# Altium schematic sheet JESD204B.SchDoc: JESD204B
size A4 portrait; Author: Carlos Barreiro; Organization: Escuela Técnica Superior de Ingeniería de Sistemas Informáticos de la Universidad Politécnica de Madrid; Address1: Campus Sur de la Universidad Politécnica de Madrid; Address2: Calle de Alan Turing, s/nº; Address3: Madrid 28031; Address4: España
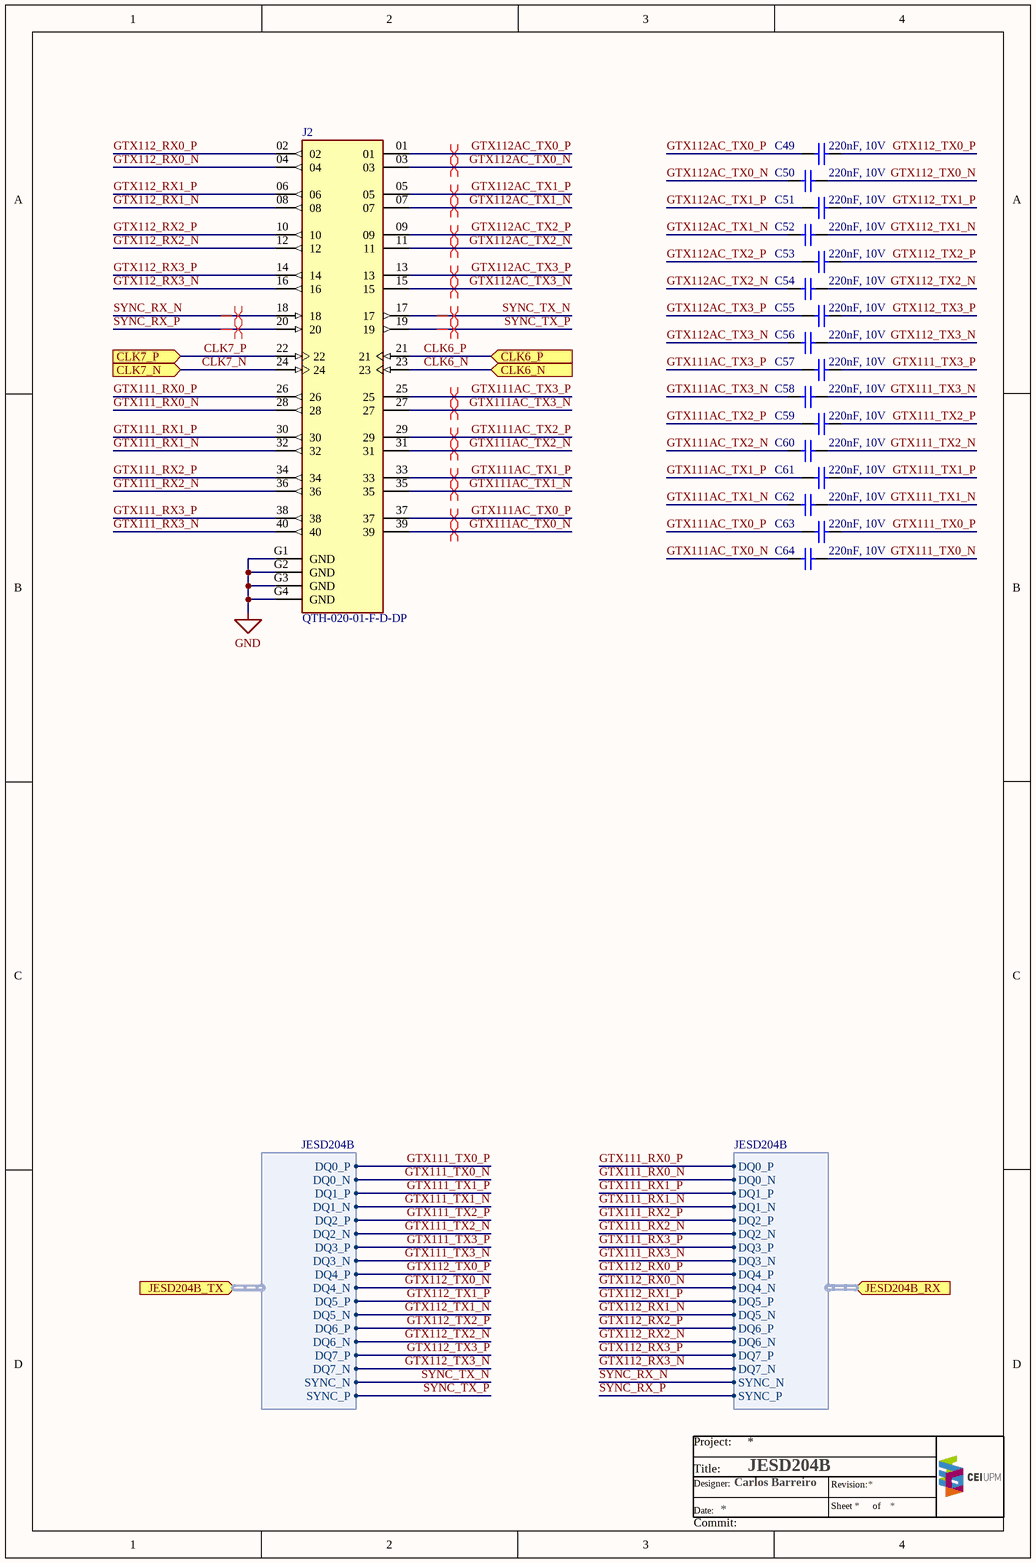
[diagram p0: JESD204B.SchDoc]

## Parts
C49  220nF, 10V  [WURTH_WCAP-CSGP_0402]
C50  220nF, 10V  [WURTH_WCAP-CSGP_0402]
C51  220nF, 10V  [WURTH_WCAP-CSGP_0402]
C52  220nF, 10V  [WURTH_WCAP-CSGP_0402]
C53  220nF, 10V  [WURTH_WCAP-CSGP_0402]
C54  220nF, 10V  [WURTH_WCAP-CSGP_0402]
C55  220nF, 10V  [WURTH_WCAP-CSGP_0402]
C56  220nF, 10V  [WURTH_WCAP-CSGP_0402]
C57  220nF, 10V  [WURTH_WCAP-CSGP_0402]
C58  220nF, 10V  [WURTH_WCAP-CSGP_0402]
C59  220nF, 10V  [WURTH_WCAP-CSGP_0402]
C60  220nF, 10V  [WURTH_WCAP-CSGP_0402]
C61  220nF, 10V  [WURTH_WCAP-CSGP_0402]
C62  220nF, 10V  [WURTH_WCAP-CSGP_0402]
C63  220nF, 10V  [WURTH_WCAP-CSGP_0402]
C64  220nF, 10V  [WURTH_WCAP-CSGP_0402]
J2  QTH-020-01-F-D-DP  [SAMTEC_QTH-020-01-X-D-DP-A]

## Ports
CLK6_N (in), CLK6_P (in), CLK7_N (in), CLK7_P (in), JESD204B_RX (in, harness JESD204B), JESD204B_TX (in, harness JESD204B)

## Harnesses
JESD204B: DQ0_P, DQ0_N, DQ1_P, DQ1_N, DQ2_P, DQ2_N, DQ3_P, DQ3_N, DQ4_P, DQ4_N, DQ5_P, DQ5_N, DQ6_P, DQ6_N, DQ7_P, DQ7_N, SYNC_N, SYNC_P

## Nets
GND: J2.G1(GND) J2.G2(GND) J2.G3(GND) J2.G4(GND)
CLK6_N: J2.23 ; port CLK6_N
CLK6_P: J2.21 ; port CLK6_P
CLK7_N: J2.24 ; port CLK7_N
CLK7_P: J2.22 ; port CLK7_P
GTX111_RX0_N: J2.28 ; port JESD204B_RX.DQ0_N
GTX111_RX0_P: J2.26 ; port JESD204B_RX.DQ0_P
GTX111_RX1_N: J2.32 ; port JESD204B_RX.DQ1_N
GTX111_RX1_P: J2.30 ; port JESD204B_RX.DQ1_P
GTX111_RX2_N: J2.36 ; port JESD204B_RX.DQ2_N
GTX111_RX2_P: J2.34 ; port JESD204B_RX.DQ2_P
GTX111_RX3_N: J2.40 ; port JESD204B_RX.DQ3_N
GTX111_RX3_P: J2.38 ; port JESD204B_RX.DQ3_P
GTX111_TX0_N: C64.2 ; port JESD204B_TX.DQ0_N
GTX111_TX0_P: C63.2 ; port JESD204B_TX.DQ0_P
GTX111_TX1_N: C62.2 ; port JESD204B_TX.DQ1_N
GTX111_TX1_P: C61.2 ; port JESD204B_TX.DQ1_P
GTX111_TX2_N: C60.2 ; port JESD204B_TX.DQ2_N
GTX111_TX2_P: C59.2 ; port JESD204B_TX.DQ2_P
GTX111_TX3_N: C58.2 ; port JESD204B_TX.DQ3_N
GTX111_TX3_P: C57.2 ; port JESD204B_TX.DQ3_P
GTX111AC_TX0_N: C64.1 J2.39
GTX111AC_TX0_P: C63.1 J2.37
GTX111AC_TX1_N: C62.1 J2.35
GTX111AC_TX1_P: C61.1 J2.33
GTX111AC_TX2_N: C60.1 J2.31
GTX111AC_TX2_P: C59.1 J2.29
GTX111AC_TX3_N: C58.1 J2.27
GTX111AC_TX3_P: C57.1 J2.25
GTX112_RX0_N: J2.04 ; port JESD204B_RX.DQ4_N
GTX112_RX0_P: J2.02 ; port JESD204B_RX.DQ4_P
GTX112_RX1_N: J2.08 ; port JESD204B_RX.DQ5_N
GTX112_RX1_P: J2.06 ; port JESD204B_RX.DQ5_P
GTX112_RX2_N: J2.12 ; port JESD204B_RX.DQ6_N
GTX112_RX2_P: J2.10 ; port JESD204B_RX.DQ6_P
GTX112_RX3_N: J2.16 ; port JESD204B_RX.DQ7_N
GTX112_RX3_P: J2.14 ; port JESD204B_RX.DQ7_P
GTX112_TX0_N: C50.2 ; port JESD204B_TX.DQ4_N
GTX112_TX0_P: C49.2 ; port JESD204B_TX.DQ4_P
GTX112_TX1_N: C52.2 ; port JESD204B_TX.DQ5_N
GTX112_TX1_P: C51.2 ; port JESD204B_TX.DQ5_P
GTX112_TX2_N: C54.2 ; port JESD204B_TX.DQ6_N
GTX112_TX2_P: C53.2 ; port JESD204B_TX.DQ6_P
GTX112_TX3_N: C56.2 ; port JESD204B_TX.DQ7_N
GTX112_TX3_P: C55.2 ; port JESD204B_TX.DQ7_P
GTX112AC_TX0_N: C50.1 J2.03
GTX112AC_TX0_P: C49.1 J2.01
GTX112AC_TX1_N: C52.1 J2.07
GTX112AC_TX1_P: C51.1 J2.05
GTX112AC_TX2_N: C54.1 J2.11
GTX112AC_TX2_P: C53.1 J2.09
GTX112AC_TX3_N: C56.1 J2.15
GTX112AC_TX3_P: C55.1 J2.13
SYNC_RX_N: J2.18 ; port JESD204B_RX.SYNC_N
SYNC_RX_P: J2.20 ; port JESD204B_RX.SYNC_P
SYNC_TX_N: J2.17 ; port JESD204B_TX.SYNC_N
SYNC_TX_P: J2.19 ; port JESD204B_TX.SYNC_P

## Layout directives
differential pair: GTX111AC_TX0_N, GTX111AC_TX0_P, GTX111AC_TX1_N, GTX111AC_TX1_P, GTX111AC_TX2_N, GTX111AC_TX2_P, GTX111AC_TX3_N, GTX111AC_TX3_P, GTX112AC_TX0_N, GTX112AC_TX0_P, GTX112AC_TX1_N, GTX112AC_TX1_P, GTX112AC_TX2_N, GTX112AC_TX2_P, GTX112AC_TX3_N, GTX112AC_TX3_P, SYNC_RX_N, SYNC_RX_P, SYNC_TX_N, SYNC_TX_P

## Notes on the sheet
- Project:
- Title:
- Date:
- Designer:
- Sheet
- Revision:
- of
- Commit:

## Library data of the parts
C49-C64 = 885012105011: WCAP-CSGP Multilayer Ceramic Chip Capacitor, General Purpose, size 0402, X5R, 220nF, 10V; Manufacturer: Wurth Elektronik; Rated Voltage: 10VDC; Isolation Resistance  min.: 2.3GOhm; Capacitance Tolerance: +/-20%; Dissipation Factor max.: 5%; Technical Reference: X5R0402224M010DFCT10000; ComponentLink1Description: Manufacturer; ComponentLink1URL: http://www.we-online.de; ComponentLink2Description: Datasheet; ComponentLink2URL: https://www.we-online.com/catalog/datasheet/885012105011.pdf; Operating Temperature: -55 to +85degC; Packaging: Tape and Reel; Manufacturer Part Number: 885012105011; Published Date: April 2021; Ceramic Type: X5R; Height: 0.5mm; Mounting Technology: SMT; Size: 0402; Capacitance: 220nF; Q-Factor min.: -
J2 = QTH-020-01-F-D-DP: 0.50 mm Q Pairs® High-Speed Ground Plane Terminal Strip, Differential Pair; MF: Samtec; MP: QTH-020-01-F-D-DP; Supplier 1: Digi-Key; Supplier 2: Mouser; Supplier Part Number 1: QTH-020-01-F-D-DP-ND; Supplier Part Number 2: 200-QTH02001FDDP; ComponentLink1Description: MF; ComponentLink1URL: https://www.samtec.com/products/qth-dp